# Altium schematic sheet Jumper5VLS.SchDoc
size A4; CompanyName: Technische Hochschule Nürnberg Georg Simon Ohm; Address1: Fürther Straße 250; Address2: 90429 Nürnberg; Address3: GERMANY; DocumentNumber: 12; SheetNumber: 12; SheetTotal: 16; CompanyName2: Institut ELSYS
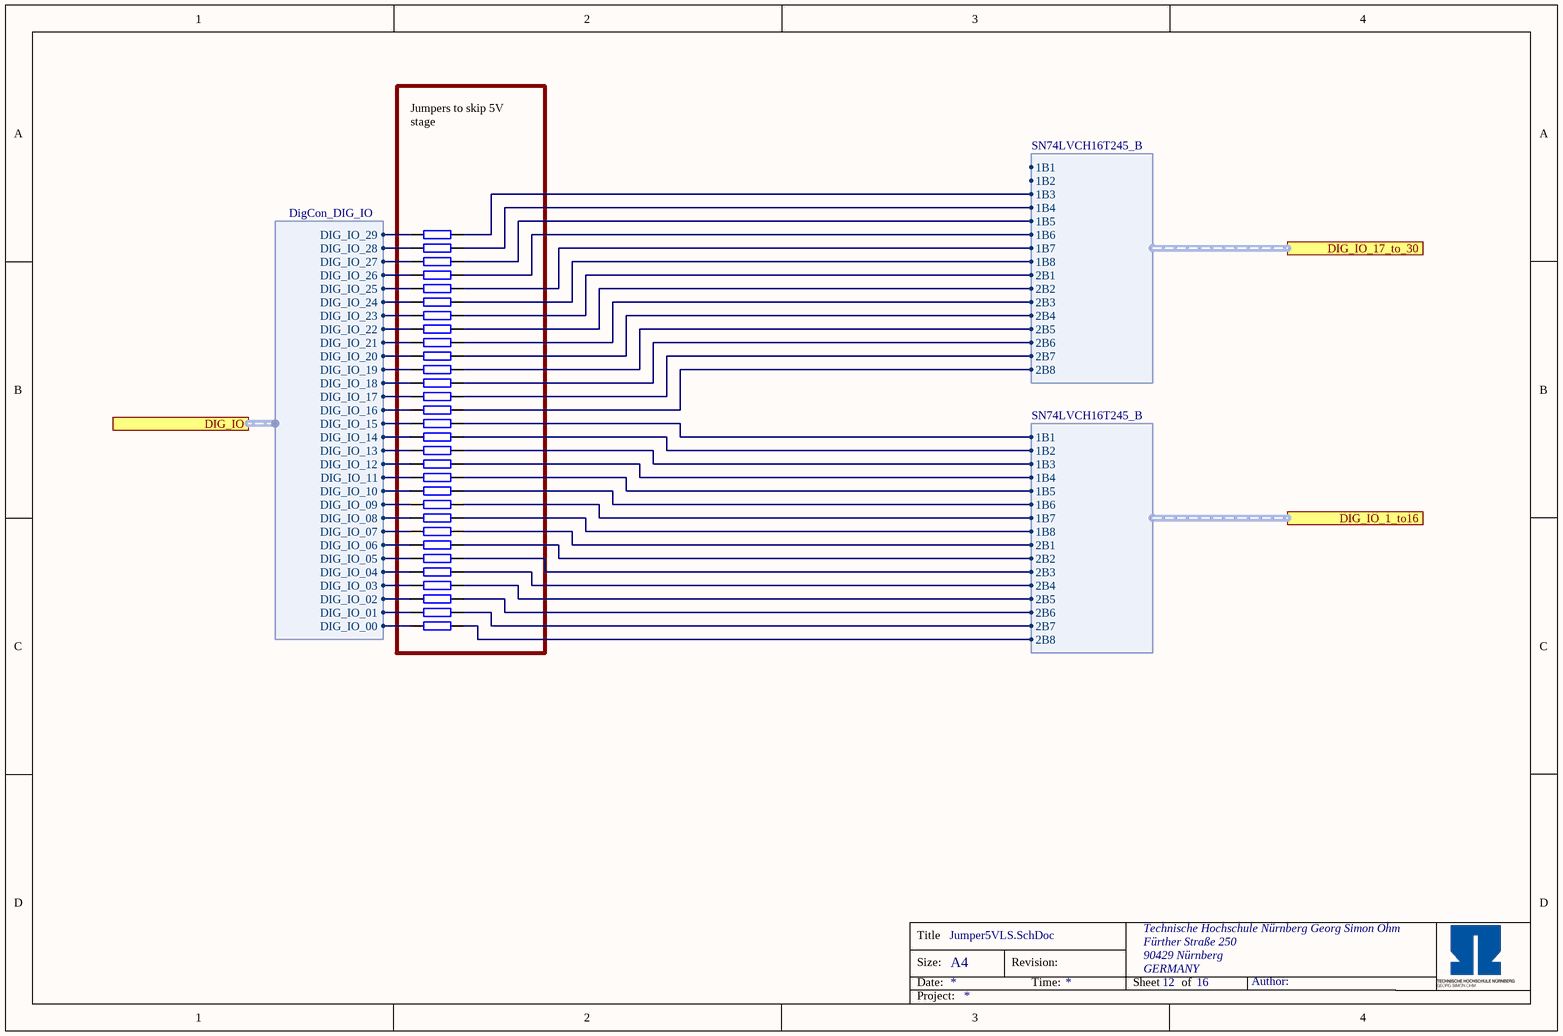
[diagram p0: Jumper5VLS.SchDoc]

## Parts
R51  0R  [RES 0603_1608]  (value not drawn)
R52  0R  [RES 0603_1608]  (value not drawn)
R53  0R  [RES 0603_1608]  (value not drawn)
R54  0R  [RES 0603_1608]  (value not drawn)
R55  0R  [RES 0603_1608]  (value not drawn)
R56  0R  [RES 0603_1608]  (value not drawn)
R57  0R  [RES 0603_1608]  (value not drawn)
R58  0R  [RES 0603_1608]  (value not drawn)
R59  0R  [RES 0603_1608]  (value not drawn)
R60  0R  [RES 0603_1608]  (value not drawn)
R61  0R  [RES 0603_1608]  (value not drawn)
R62  0R  [RES 0603_1608]  (value not drawn)
R63  0R  [RES 0603_1608]  (value not drawn)
R64  0R  [RES 0603_1608]  (value not drawn)
R65  0R  [RES 0603_1608]  (value not drawn)
R66  0R  [RES 0603_1608]  (value not drawn)
R67  0R  [RES 0603_1608]  (value not drawn)
R68  0R  [RES 0603_1608]  (value not drawn)
R69  0R  [RES 0603_1608]  (value not drawn)
R70  0R  [RES 0603_1608]  (value not drawn)
R71  0R  [RES 0603_1608]  (value not drawn)
R72  0R  [RES 0603_1608]  (value not drawn)
R73  0R  [RES 0603_1608]  (value not drawn)
R74  0R  [RES 0603_1608]  (value not drawn)
R75  0R  [RES 0603_1608]  (value not drawn)
R76  0R  [RES 0603_1608]  (value not drawn)
R77  0R  [RES 0603_1608]  (value not drawn)
R78  0R  [RES 0603_1608]  (value not drawn)
R79  0R  [RES 0603_1608]  (value not drawn)
R80  0R  [RES 0603_1608]  (value not drawn)

## Ports
DIG_IO (harness DigCon_DIG_IO), DIG_IO_1_to16 (harness SN74LVCH16T245_B), DIG_IO_17_to_30 (harness SN74LVCH16T245_B)

## Harnesses
SN74LVCH16T245_B: 1B1, 1B2, 1B3, 1B4, 1B5, 1B6, 1B7, 1B8, 2B1, 2B2, 2B3, 2B4, 2B5, 2B6, 2B7, 2B8
DigCon_DIG_IO: DIG_IO_00, DIG_IO_01, DIG_IO_02, DIG_IO_03, DIG_IO_04, DIG_IO_05, DIG_IO_06, DIG_IO_07, DIG_IO_08, DIG_IO_09, DIG_IO_10, DIG_IO_11, DIG_IO_12, DIG_IO_13, DIG_IO_14, DIG_IO_15, DIG_IO_16, DIG_IO_17, DIG_IO_18, DIG_IO_19, DIG_IO_20, DIG_IO_21, DIG_IO_22, DIG_IO_23, DIG_IO_24, DIG_IO_25, DIG_IO_26, DIG_IO_27, DIG_IO_28, DIG_IO_29

## Nets
NetR51_1: R51.1 ; port DIG_IO.DIG_IO_29
NetR51_2: R51.2 ; port DIG_IO_17_to_30.1B3
NetR52_1: R52.1 ; port DIG_IO.DIG_IO_28
NetR52_2: R52.2 ; port DIG_IO_17_to_30.1B4
NetR53_1: R53.1 ; port DIG_IO.DIG_IO_27
NetR53_2: R53.2 ; port DIG_IO_17_to_30.1B5
NetR54_1: R54.1 ; port DIG_IO.DIG_IO_26
NetR54_2: R54.2 ; port DIG_IO_17_to_30.1B6
NetR55_1: R55.1 ; port DIG_IO.DIG_IO_25
NetR55_2: R55.2 ; port DIG_IO_17_to_30.1B7
NetR56_1: R56.1 ; port DIG_IO.DIG_IO_24
NetR56_2: R56.2 ; port DIG_IO_17_to_30.1B8
NetR57_1: R57.1 ; port DIG_IO.DIG_IO_23
NetR57_2: R57.2 ; port DIG_IO_17_to_30.2B1
NetR58_1: R58.1 ; port DIG_IO.DIG_IO_22
NetR58_2: R58.2 ; port DIG_IO_17_to_30.2B2
NetR59_1: R59.1 ; port DIG_IO.DIG_IO_21
NetR59_2: R59.2 ; port DIG_IO_17_to_30.2B3
NetR60_1: R60.1 ; port DIG_IO.DIG_IO_20
NetR60_2: R60.2 ; port DIG_IO_17_to_30.2B4
NetR61_1: R61.1 ; port DIG_IO.DIG_IO_19
NetR61_2: R61.2 ; port DIG_IO_17_to_30.2B5
NetR62_1: R62.1 ; port DIG_IO.DIG_IO_18
NetR62_2: R62.2 ; port DIG_IO_17_to_30.2B6
NetR63_1: R63.1 ; port DIG_IO.DIG_IO_17
NetR63_2: R63.2 ; port DIG_IO_17_to_30.2B7
NetR64_1: R64.1 ; port DIG_IO.DIG_IO_16
NetR64_2: R64.2 ; port DIG_IO_17_to_30.2B8
NetR65_1: R65.1 ; port DIG_IO.DIG_IO_15
NetR65_2: R65.2 ; port DIG_IO_1_to16.1B1
NetR66_1: R66.1 ; port DIG_IO.DIG_IO_14
NetR66_2: R66.2 ; port DIG_IO_1_to16.1B2
NetR67_1: R67.1 ; port DIG_IO.DIG_IO_13
NetR67_2: R67.2 ; port DIG_IO_1_to16.1B3
NetR68_1: R68.1 ; port DIG_IO.DIG_IO_12
NetR68_2: R68.2 ; port DIG_IO_1_to16.1B4
NetR69_1: R69.1 ; port DIG_IO.DIG_IO_11
NetR69_2: R69.2 ; port DIG_IO_1_to16.1B5
NetR70_1: R70.1 ; port DIG_IO.DIG_IO_10
NetR70_2: R70.2 ; port DIG_IO_1_to16.1B6
NetR71_1: R71.1 ; port DIG_IO.DIG_IO_09
NetR71_2: R71.2 ; port DIG_IO_1_to16.1B7
NetR72_1: R72.1 ; port DIG_IO.DIG_IO_08
NetR72_2: R72.2 ; port DIG_IO_1_to16.1B8
NetR73_1: R73.1 ; port DIG_IO.DIG_IO_07
NetR73_2: R73.2 ; port DIG_IO_1_to16.2B1
NetR74_1: R74.1 ; port DIG_IO.DIG_IO_06
NetR74_2: R74.2 ; port DIG_IO_1_to16.2B2
NetR75_1: R75.1 ; port DIG_IO.DIG_IO_05
NetR75_2: R75.2 ; port DIG_IO_1_to16.2B3
NetR76_1: R76.1 ; port DIG_IO.DIG_IO_04
NetR76_2: R76.2 ; port DIG_IO_1_to16.2B4
NetR77_1: R77.1 ; port DIG_IO.DIG_IO_03
NetR77_2: R77.2 ; port DIG_IO_1_to16.2B5
NetR78_1: R78.1 ; port DIG_IO.DIG_IO_02
NetR78_2: R78.2 ; port DIG_IO_1_to16.2B6
NetR79_1: R79.1 ; port DIG_IO.DIG_IO_01
NetR79_2: R79.2 ; port DIG_IO_1_to16.2B7
NetR80_1: R80.1 ; port DIG_IO.DIG_IO_00
NetR80_2: R80.2 ; port DIG_IO_1_to16.2B8

## Notes on the sheet
- Jumpers to skip 5V stage
- Title
- Size:
- Date:
- A4
- Revision:
- Time:
- Sheet
- of
- Author:
- Project:

## Library data of the parts
R51-R80 = RC0603JR-070RL: SMD resistor E24 series; Manufacturer: YAGEO; Tolerance: 5%; Created from: MGremer; Manufacturer Part Number: RC0603JR-070RL; PartID: 1; Created On: 14.12.2020 16:17:14; ComponentLink1Description: Datasheet; ComponentLink1URL: https://www.mouser.de/datasheet/2/447/PYu-RC_Group_51_RoHS_L_10-1664068.pdf; Component Type: SMD resistor; Device Package: 0603; Last Updated: 04.03.2021 09:09:42; Mounting Type: SMD; Supplier 1: Mouser; Supplier Part Number 1: 603-RC0603JR-070RL; Type: Resistor; Value: 0R; Live Cycle Status: 1; Stock number: Labor SMD Container; LCSC Part Number: C21189; Supplier 2: LCSC; Supplier Part Number 2: C21189